# Altium schematic sheet MAIN_PCB.SchDoc: Sensor project
size A; SheetNumber: 1; SheetTotal: 1
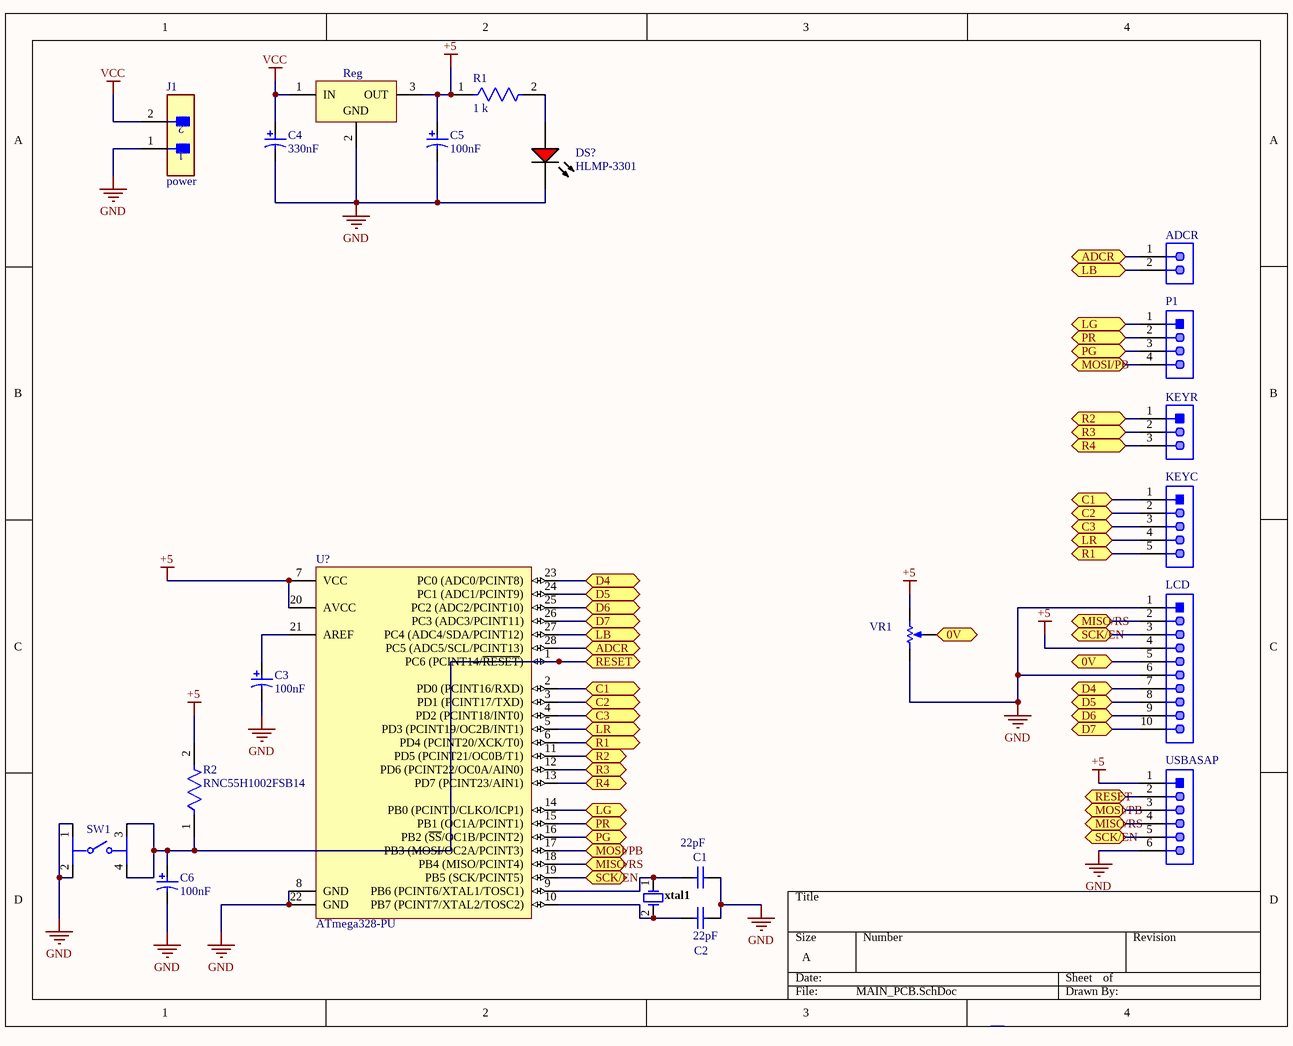
[diagram p0: MAIN_PCB.SchDoc]

## Parts
ADCR  5-146280-2  [TECO-5-146280-2_V]  (value not drawn)
C1  22pF  [KEMT-C315-THT-2]
C2  22pF  [KEMT-C315-THT-2]
C3  100nF  [CAPPR55-200-1100X500X1200]
C4  330nF  [CAPPR55-200-1100X500X1200]
C5  100nF  [CAPPR55-200-1100X500X1200]
C6  100nF  [CAPPR55-200-1100X500X1200]
DS?  HLMP-3301  [AVAG-HLMP-3301-2]
J1  power  [FP-B2B-XH-A_LF_SN-MFG]
KEYC  61300511121  [61300511121]  (value not drawn)
KEYR  22-28-4033  [MOLX-22-28-4033_V]  (value not drawn)
LCD  61301011121  [61301011121]  (value not drawn)
P1  61300411121  [61300411121]  (value not drawn)
R1  1 k  [FP-RNC55-MFG]
R2  RNC55H1002FSB14  [FP-RNC55-MFG]
Reg  (no value)  [TO220]
SW1  (no value)  [FP-3-1825910-1-MFG]
U?  ATmega328-PU  [28P3]
USBASAP  61300611121  [61300611121]  (value not drawn)
VR1  3362P-1-103LF  [BOUR-3362P]  (value not drawn)
xtal1  FOXSLF/160-20  [FOX-FOXSLF160-20]  (value not drawn)

## Ports
0V (bidir), ADCR (bidir), C1 (bidir), C2 (bidir), C3 (bidir), D4 (bidir), D5 (bidir), D6 (bidir), D7 (bidir), LB (bidir), LG (bidir), LR (bidir), MISO/RS (bidir), MOSI/PB (bidir), PG (bidir), PR (bidir), R1 (bidir), R2 (bidir), R3 (bidir), R4 (bidir), RESET (bidir), SCK/EN (bidir)

## Nets
+5: C5.1 LCD.4 R1.1 R2.2 Reg.3(OUT) U?.7(VCC) U?.20(AVCC) USBASAP.1 VR1.3(CW)
GND: C1.2 C2.2 C3.2 C4.2 C5.2 C6.2 DS?.1(K) J1.1 LCD.1 LCD.6 Reg.2(GND) SW1.1 SW1.2 U?.8(GND) U?.22(GND) USBASAP.6 VR1.1(CCW)
VCC: C4.1 J1.2 Reg.1(IN)
0V: LCD.5 VR1.2(S) ; port 0V
ADCR: ADCR.1 U?.28(PC5_(ADC5/SCL/PCINT13)) ; port ADCR
C1: KEYC.1 U?.2(PD0_(PCINT16/RXD)) ; port C1
C2: KEYC.2 U?.3(PD1_(PCINT17/TXD)) ; port C2
C3: KEYC.3 U?.4(PD2_(PCINT18/INT0)) ; port C3
D4: LCD.7 U?.23(PC0_(ADC0/PCINT8)) ; port D4
D5: LCD.8 U?.24(PC1_(ADC1/PCINT9)) ; port D5
D6: LCD.9 U?.25(PC2_(ADC2/PCINT10)) ; port D6
D7: LCD.10 U?.26(PC3_(ADC3/PCINT11)) ; port D7
LB: ADCR.2 U?.27(PC4_(ADC4/SDA/PCINT12)) ; port LB
LG: P1.1 U?.14(PB0_(PCINT0/CLKO/ICP1)) ; port LG
LR: KEYC.4 U?.5(PD3_(PCINT19/OC2B/INT1)) ; port LR
MISO/RS: LCD.2 U?.18(PB4_(MISO/PCINT4)) USBASAP.4 ; port MISO/RS
MOSI/PB: P1.4 U?.17(PB3_(MOSI/OC2A/PCINT3)) USBASAP.3 ; port MOSI/PB
PG: P1.3 U?.16(PB2_(~{SS}/OC1B/PCINT2)) ; port PG
PR: P1.2 U?.15(PB1_(OC1A/PCINT1)) ; port PR
R1: KEYC.5 U?.6(PD4_(PCINT20/XCK/T0)) ; port R1
R2: KEYR.1 U?.11(PD5_(PCINT21/OC0B/T1)) ; port R2
R3: KEYR.2 U?.12(PD6_(PCINT22/OC0A/AIN0)) ; port R3
R4: KEYR.3 U?.13(PD7_(PCINT23/AIN1)) ; port R4
RESET: C6.1 R2.1 SW1.3 SW1.4 U?.1(PC6_(PCINT14/~{RESET})) USBASAP.2 ; port RESET
SCK/EN: LCD.3 U?.19(PB5_(SCK/PCINT5)) USBASAP.5 ; port SCK/EN
NetC1_1: C1.1 U?.9(PB6_(PCINT6/XTAL1/TOSC1)) xtal1.1
NetC2_1: C2.1 U?.10(PB7_(PCINT7/XTAL2/TOSC2)) xtal1.2
NetC3_1: C3.1 U?.21(AREF)
NetDS?_2: DS?.2(A) R1.2

## Library data of the parts
ADCR = CMP-2000-07492-1: Male Header, Pitch 2.54 mm, 1 x 2 Position, Height 8.21 mm, Tail Length 3.05 mm, -65 to 105 degC, RoHS, Bulk; Manufacturer: TE Connectivity; Mating Connector Lock: No(Without); Number of Positions: 2; Pitch: 2.54mm; PCB Mounting Orientation: Vertical; Keyed: No; Case\/Package: 100; Mating Post Length: 0.23inch; High Temperature Housing: Yes; Max Current Rating: 5A; PCB Thickness: 0.063inch; PCB Mount Retention: Without; Approvals: CSA; Current Rating: 3A; Radiation Hardening: No; Length: 4.67mm; Contact Mating Length: 0.23inch; Connector Type: Header; Number of Rows: 1; Termination Post Length: 0.12inch; Board Standoff: No(Without); Max Operating Temperature: 105degC; Contact Shape: Square; Selectively Loaded: No(Without); Gasket: No(Without); Number of Contacts: 2; Contact Gender: Male; Mating Alignment: No(Without); Manufacturer URL: http://www.te.com/; Datasheet URL: http://www.te.com/commerce/DocumentDelivery/DDEController?Action=showdoc&DocId=Customer+Drawing%7F146280%7FH1%7Fpdf%7FEnglish%7FENG_CD_146280_H1.pdf%7F5-146280-2; Mount: ThroughHole; Orientation: Straight; Packaging: Carton; Package Reference: 5-146280-2; Package Quantity: 500; Stabilizers: No(Without); Row Spacing: 2.54mm; Contact Material: CopperAlloy; Panel Mount Retention: No(Without); Datasheet Version: Rev. H1, 08/2016; Housing Colour: Black; Colour: Black; Package Description: Male Header, Pitch 2.54 mm, 1 x 2 Position, Height 8.21 mm, Tail Length 3.05 mm; Contact Plating: Matte; Housing Material: Polymer; Contact Protection: No(Without); Min Operating Temperature: -65degC; Mounting Technology: ThroughHole; Flammability Rating: UL94V-0; RoHSCompliant: true; Termination: ThroughHole; Depth: 2.34mm; High Speed Serial Data Connector: No
C1 C2 = CMP-1664-00008-1: Capacitor, Ceramic, 22 pF, +/-10 %, 100 V, -55 to 125 degC, 2-Pin THD, RoHS, Bulk; Max Input Voltage: 40 V; Min Input Voltage: 4.2 V; Output Current: 1.5 A; Output Voltage: 1.2 V; Outputs: 1; Case\Package: TO-220; RoHSCompliant: true; Min Operating Temperature: 0 degC; Max Operating Temperature: 125 degC; Package Quantity: 50; ComponentLink2URL: http://capacitoredge.kemet.com/capedge2/DataSheet/Datasheet-C315C220K1G5TA.pdf?pn=C315C220K1G5TA{BULK}; Radiation Hardening: No; Pins: 3; Length: 10.28 mm; ComponentLink1URL: http://www.kemet.com/; ComponentLink2Description: Datasheet; Height: 9.28 mm; REACH SVHC: No SVHC; ComponentLink1Description: Manufacturer URL; Max Ouput Current: 1.5 A; Weight: 0.08113 oz; Packaging: Rail/Tube; DatasheetVersion: Aug-16; Mount: Through Hole; PackageReference: C315-THT-2; Width: 4.82 mm; PackageDescription: 2-Pin Through Hole Device, Body 3.81 x 2.54 mm
C3-C6 = CMP-1665-00039-1: Aluminum Electrolytic Capacitor, 1 uF, +/- 20%, 50 V, -55 to 105 degC, 2-Pin THD, RoHS, Bulk; Channels: 2; ComponentLink1Description: Manufacturer URL; ComponentLink2Description: Datasheet; ComponentLink2URL: https://datasheet.ciiva.com/7275/94060-7275472.pdf; PackageDescription: 2-Pin Radial Lead, Dia 5 mm, Body Length 11 mm; PackageReference: CAPPR55-200-1100X500X1200; Mount: Through Hole; Radiation Hardening: No; ComponentLink1URL: http://www.panasonic.com/; Min Operating Temperature: -30 degC; Package Quantity: 150; Max Operating Temperature: 70 degC; DatasheetVersion: Mar-05; RoHSCompliant: true; Packaging: Bulk
DS? = CMP-2000-06411-1: T-1 3/4 (5 mm) Diffused LED Lamp, 1.9 V, -40 to 100 degC, 2-Pin THD, RoHS, Bulk; Manufacturer: Avago; Forward Current: 25mA; Forward Voltage: 2.4V; Peak Wavelength: 635nm; Shape Type: Circular; High Brightness: No; Main Category: StandardLED; Test Current (It): 10mA; Dominant Wave Length: 626nm; Number of  Elements: 1; Reverse Voltage: 5V; Chip Material: GaP; Product Height (mm): 9.19mm; Lens Type: ColoredDiffused; Viewing Angle: 60deg; Type: Uni-Color; Emitting Color: Red; Luminous Intensity: 5.4mcd; Power Dissipation: 85W; DELETED: Compliant; Product Depth (mm): 6.1mm; Package Description: 2-Pin Through Hole LED, Dia 5.85 mm; Mounting Technology: ThroughHole; Manufacturer URL: http://www.avagotech.com/; Package Type: T-13/4; Operating Temp Range: -40Cto100C; Datasheet URL: http://www.avagotech.com/docs/AV02-1558EN; Mounting: ThroughHole; Lens Dimensions: 5.08x5.08x8.3mm; Package Reference: HLMP-3301; Datasheet Version: 03/2015; Pin Count: 2; Packaging: TapeandReel; Operating Temperature Classification: Industrial; Lum Intensity: 5.4mcd; Rad Hardened: No; Product Length (mm): 6.1mm
J1 = CMP-2000-05888-3: CONN HEADER VERT 2POS 2.5MM; Current Rating: 3A; Voltage Rating: 250V; Number of Contacts: 2; Contact Resistance: 20mR; Wire/Cable Gauge: 22AWG; Insulation Resistance: 1GR; Connector Type: Male Pin; Packaging: Bulk; Contact Material: Brass; Lead Free: Lead Free; Orientation: Straight; Contact Plating: Tin; Max Current Rating: 3A; Termination: Solder; Fastening Type: Detent; Depth: 5.75mm; Housing Material: Polyamide; REACH SVHC: No SVHC; Series: XH; Voltage Rating (AC): 250V; Number of Positions: 2; Color: Natural; Contact Type: Male Pin; Max Voltage Rating (DC): 250V; Pitch: 2.5mm; Lead Pitch: 2.5mm; Mount: Through Hole; Max Operating Temperature: 85°C; Length: 7.4mm; Max Voltage Rating (AC): 250V; Min Operating Temperature: -25°C; Number of Rows: 1; Housing Color: White
KEYC = CMP-1502-01068-1: THT Vertical Pin Header WR-PHD, Pitch 2.54 mm, Single Row, 5 pins; Manufacturer: Wurth Elektronik; Pin Number: 5; Contact Resistance: 20mOhm; Working Voltage: 250VAC; Pitch: 2.54mm; Withstanding Voltage: 500VAC; Rated Current: 3A; Gender: Male; Datasheet URL: https://katalog.we-online.de/em/datasheet/6130xx11121.pdf; Orientation: Vertical; Mounting Technology: THT; Row Number: Single; Package Reference: 61300511121; Publisher: WurthElektronik; Part Number: 61300511121; Packaging: Bag; Manufacturer URL: http://www.we-online.de; Operating Temperature: -40to105degC
KEYR = CMP-1676-00001-5: Male Header, Pitch 2.54 mm, 1 x 3 Position, Height 8.38 mm, Tail Length 3.18 mm, RoHS, Bulk; Manufacturer: Molex; Rows: 1; Voltage Rating: 250 V; Current Rating: 4 A; Min Operating Temperature: 0 degC; Lead Pitch: 0.1 inch; Packaging: Bulk; Contact Finish: Gold; RoHSCompliant: true; Contact Material: Brass; PackageReference: 22-28-4033; REACH SVHC: Unknown; PackageDescription: Male Header, Pitch 2.54 mm, 1 x 3 Position, Height 8.38 mm, Tail Length 3.18 mm; ComponentLink2URL: http://www.molex.com/pdm_docs/sd/022284033_sd.pdf; Height: 8.38 mm; Mounting Technology: Through Hole; ComponentLink1Description: Manufacturer URL; Length: 7.62 mm; Mount: Through Hole; DatasheetVersion: Rev. G, 01/2012; Max Operating Temperature: 75 degC; ComponentLink2Description: Datasheet; Colour: Black; Pins: 3; Contact Plating: Gold; Package Quantity: 1; ComponentLink1URL: http://www.molex.com/
LCD = CMP-1502-01082-1: THT Vertical Pin Header WR-PHD, Pitch 2.54 mm, Single Row, 10 pins; Manufacturer: Wurth Elektronik; Contact Resistance: 20mOhm; Rated Current: 3A; Pitch: 2.54mm; Gender: Male; Pin Number: 10; Working Voltage: 250VAC; Withstanding Voltage: 500VAC; Manufacturer URL: http://www.we-online.de; Operating Temperature: -40to105degC; Datasheet URL: https://katalog.we-online.de/em/datasheet/6130xx11121.pdf; Row Number: Single; Orientation: Vertical; Part Number: 61301011121; Packaging: Bag; Package Reference: 61301011121; Mounting Technology: THT; Publisher: WurthElektronik
P1 = CMP-1502-01064-1: THT Vertical Pin Header WR-PHD, Pitch 2.54 mm, Single Row, 4 pins; Manufacturer: Wurth Elektronik; Withstanding Voltage: 500VAC; Rated Current: 3A; Working Voltage: 250VAC; Pin Number: 4; Gender: Male; Contact Resistance: 20mOhm; Pitch: 2.54mm; Manufacturer URL: http://www.we-online.de; Operating Temperature: -40to105degC; Packaging: Bag; Mounting Technology: THT; Package Reference: 61300411121; Datasheet URL: https://katalog.we-online.de/em/datasheet/6130xx11121.pdf; Publisher: WurthElektronik; Part Number: 61300411121; Row Number: Single; Orientation: Vertical
R1 = CMP-02408-000004-1: RES 10K OHM 1/8W 1% AXIAL; Manufacturer Part Number: RNC55H1002FSB14; Manufacturer: Vishay; Voltage Rating: 200V; Power Rating: 0.125W; Resistance: 1kΩ; Temperature Coefficient: 50ppm/°C; Value: 1kΩ; Automotive: No; Category: Res; Tolerance: 1%; Temperature: -65°C to +175°C; Device Class L2: Resistors; Composition: Metal Film; Height: 2.69mm; Failure Rate: 0.001%; ComponentLink2URL: https://www.vishay.com/docs/31025/erc.pdf; Temperature Range High: +175°C; Lead Free: No; Series: RNC; Device Class L1: Passive Components; Ipc Land Pattern Name: RESAD1100W85L762D269; Octopart: https://octopart.com/rnc55h1002fs-vishay-40848808; Package: RNC55; RoHS: FALSE; Military Standard: true; Device Class L3: Through-Hole Resistors; ComponentLink2Description: Datasheet; Digikey Description: RES 10K OHM 1/8W 1% AXIAL; Temperature Range Low: -65°C
R2 = CMP-02408-000004-1: RES 10K OHM 1/8W 1% AXIAL; Manufacturer: Vishay; Voltage Rating: 200V; Power Rating: 0.125W; Resistance: 10kΩ; Temperature Coefficient: 50ppm/°C; Value: 10kΩ; Automotive: No; Category: Res; Tolerance: 1%; Temperature: -65°C to +175°C; Device Class L2: Resistors; Composition: Metal Film; Height: 2.69mm; Failure Rate: 0.001%; ComponentLink2URL: https://www.vishay.com/docs/31025/erc.pdf; Manufacturer Part Number: RNC55H1002FSB14; Temperature Range High: +175°C; Lead Free: No; Series: RNC; Device Class L1: Passive Components; Ipc Land Pattern Name: RESAD1100W85L762D269; Octopart: https://octopart.com/rnc55h1002fs-vishay-40848808; Package: RNC55; RoHS: FALSE; Military Standard: true; Device Class L3: Through-Hole Resistors; ComponentLink2Description: Datasheet; Digikey Description: RES 10K OHM 1/8W 1% AXIAL; Temperature Range Low: -65°C
Reg = CMP-0244-00483-1: Positive Voltage Regulator, 5V, 3-Pin TO-220; PackageDescription: TO, Thru-Hole, Vertical, Heatsink Mounted; 3 In-Line Leads; Pitch 2.54 mm; ComponentLink2Description: Datasheet; PackageReference: TO220; ComponentLink3URL: http://www.st.com/internet/com/TECHNICAL_RESOURCES/TECHNICAL_LITERATURE/PACKAGE_INFORMATION/CD00004649.pdf; DatasheetVersion: 16/11/2011; ComponentLink1Description: Manufacturer URL; ComponentLink1URL: http://www.st.com; PackageVersion: ver3.0; ComponentLink3Description: Package Specification; ComponentLink2URL: http://www.st.com/internet/com/TECHNICAL_RESOURCES/TECHNICAL_LITERATURE/DATASHEET/CD00000444.pdf
SW1 = CMP-03407-000001-1: SWITCH TACTILE SPST-NO 0.05A 24V; Manufacturer: TE Connectivity; Manufacturer Part Number: 3-1825910-1; Operating Force: 160gf; Contact Current Rating: 50mA; Contact Resistance: 100mΩ; Electromechanical Life: 100000Cycles; Device Class L1: Electromechanical; ComponentLink2URL: https://www.te.com/commerce/DocumentDelivery/DDEController?Action=srchrtrv&DocNm=1825910&DocType=Customer+Drawing&DocLang=English; Category: Switch; Device Class L2: Switches; Temperature: -35°C to +85°C; RoHS: TRUE; Mount: Through Hole; Automotive: No; Lead Free: Yes; Device Class L3: Tactile Switches; ComponentLink2Description: Datasheet; Temperature Range High: +85°C; Height: 17.3mm; Package: 0; Temperature Range Low: -35°C; Throw Configuration: SPST-NO; Digikey Description: SWITCH TACTILE SPST-NO 0.05A 24V; Octopart: https://octopart.com/3-1825910-1-te+connectivity-46506874
U? = CMP-0095-00015-2: 8-bit AVR Microcontroller, 32KB Flash, 1KB EEPROM, 2KB SRAM, 28-pin PDIP, Industrial Grade (-40°C to 85°C); ComponentLink3Description: ATmega48A/48PA/88A/88PA/168A/168PA/328/328P Summary; RevisionNote: DatasheetVersion updated. URLs added.; DatasheetVersion: revD, May-2011; ComponentLink1URL: http://www.atmel.com/; PackageVersion: revB, Sep-2001; PackageDescription: 28-lead (0.300"/7.62mm Wide) Plastic Dual Inline Package (PDIP); PackageReference: 28P3; ComponentLink1Description: Manufacturer URL; ComponentLink2Description: ATmega48A/48PA/88A/88PA/168A/168PA/328/328P Datasheet; ComponentLink3URL: http://www.atmel.com/dyn/resources/prod_documents/8271S.pdf; ComponentLink2URL: http://www.atmel.com/dyn/resources/prod_documents/8271.pdf
USBASAP = CMP-1502-01070-1: THT Vertical Pin Header WR-PHD, Pitch 2.54 mm, Single Row, 6 pins; Manufacturer: Wurth Elektronik; Gender: Male; Pin Number: 6; Pitch: 2.54mm; Working Voltage: 250VAC; Rated Current: 3A; Withstanding Voltage: 500VAC; Contact Resistance: 20mOhm; Operating Temperature: -40to105degC; Packaging: Bag; Datasheet URL: https://katalog.we-online.de/em/datasheet/6130xx11121.pdf; Package Reference: 61300611121; Mounting Technology: THT; Publisher: WurthElektronik; Part Number: 61300611121; Manufacturer URL: http://www.we-online.de; Row Number: Single; Orientation: Vertical
VR1 = CMP-1747-00004-1: Square Trimpot(R) Trimming Potentiometer, 10 KOhm, 300 V, -55 to 125 degC, 3-Pin THD, RoHS, Tube; Voltage Rating: 220 mV; Power Rating: 1 W; Tolerance: 1%; Resistance: 50 mohm; Case/Package: 1206; Length: 3.2 mm; RoHSCompliant: True; PackageDescription: 3-Pin Through Hole Device, Body 6.6 x 6.99 mm, Pitch 2.54 mm; ComponentLink2Description: Datasheet; REACH SVHC: No SVHC; Mount: Surface Mount; Height: 0.6 mm; Packaging: Tape and Reel; ComponentLink1URL: http://www.bourns.com/; Case Code (Imperial): 0612; Pins: 2; Case Code (Metric): 1632; ComponentLink2URL: http://www.bourns.com/docs/Product-Datasheets/3362.pdf; Min Operating Temperature: -25degC; ComponentLink1Description: Manufacturer URL; PackageReference: 3326P; Max Operating Temperature: 125degC; Width: 1.6 mm; Package Quantity: 5000; DatasheetVersion: May-16
xtal1 = CMP-1749-00003-1: Resistance Weld Thru-Hole Crystal, 16 MHz, -20 to 70 degC, 2-Pin THD, RoHS, Bulk; Voltage Rating: 250 V; Tolerance: 1%; Resistance: 221 kohm; Case\Package: Axial; Power Rating: 250 mW; RoHSCompliant: true; Package Quantity: 200; Packaging: Bulk; Min Operating Temperature: -55 degC; DatasheetVersion: Mar-15; ComponentLink1URL: http://www.foxonline.com/; Max Operating Temperature: 155 degC; PackageReference: FOXSLF160-20; Mount: Through Hole; PackageDescription: 2-Pin Through Hole Device, Body 11.35 x 4.65 mm; ComponentLink1Description: Manufacturer URL; ComponentLink2URL: http://www.foxonline.com/pdfs/hc49slf.pdf; ComponentLink2Description: Datasheet; Length: 0.248 inch